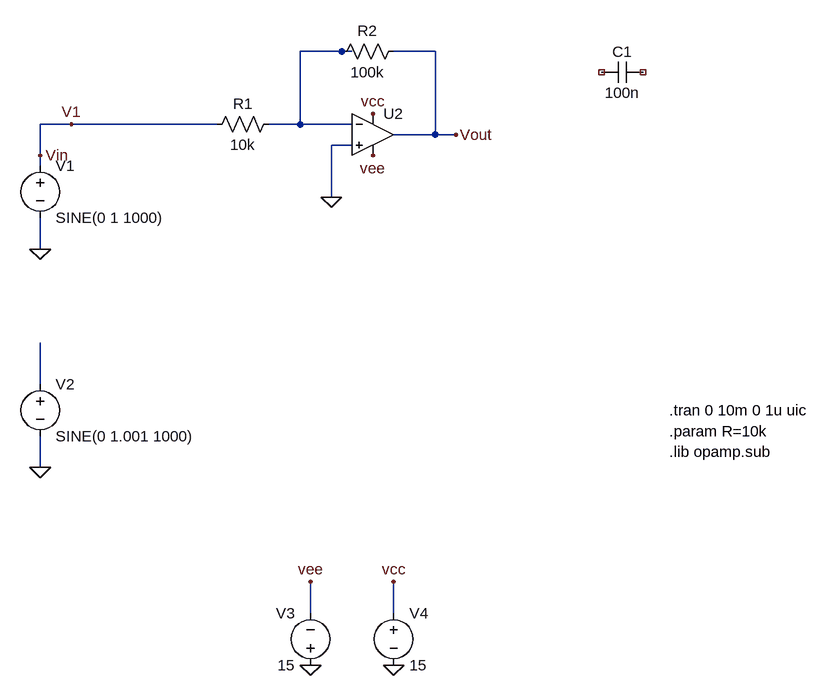
[diagram p0: schematic estudo1.asc]
estudo1.asc, the LTspice schematic file:
Version 4.1
SHEET 1 1364 708
WIRE 16 -256 -48 -256
WIRE 32 -256 16 -256
WIRE 160 -256 96 -256
WIRE -400 -144 -448 -144
WIRE -176 -144 -400 -144
WIRE -48 -144 -48 -256
WIRE -48 -144 -96 -144
WIRE 32 -144 -48 -144
WIRE 160 -128 160 -256
WIRE 160 -128 96 -128
WIRE 192 -128 160 -128
WIRE 32 -112 0 -112
WIRE -448 -96 -448 -144
WIRE -448 -80 -448 -96
WIRE 0 -32 0 -112
WIRE -448 48 -448 0
WIRE -448 256 -448 192
WIRE -448 384 -448 336
WIRE -32 608 -32 560
WIRE 96 608 96 560
FLAG -448 48 0
FLAG -448 384 0
FLAG 64 -96 vee
FLAG 64 -160 vcc
FLAG -32 688 0
FLAG 96 688 0
FLAG -400 -144 V1
FLAG -32 560 vee
FLAG 96 560 vcc
FLAG 0 -32 0
FLAG 192 -128 Vout
FLAG -448 -96 Vin
SYMBOL voltage -448 -96 R0
WINDOW 123 0 0 Left 0
WINDOW 39 0 0 Left 0
SYMATTR InstName V1
SYMATTR Value SINE(0 1 1000)
SYMBOL voltage -448 240 R0
WINDOW 123 0 0 Left 0
WINDOW 39 0 0 Left 0
SYMATTR InstName V2
SYMATTR Value SINE(0 1.001 1000)
SYMBOL voltage -32 704 R180
WINDOW 0 24 96 Left 2
WINDOW 3 24 16 Left 2
WINDOW 123 0 0 Left 0
WINDOW 39 0 0 Left 0
SYMATTR InstName V3
SYMATTR Value 15
SYMBOL voltage 96 592 R0
WINDOW 123 0 0 Left 0
WINDOW 39 0 0 Left 0
SYMATTR InstName V4
SYMATTR Value 15
SYMBOL OpAmps\\UniversalOpAmp2 64 -128 R0
SYMATTR InstName U2
SYMBOL res -80 -160 R90
WINDOW 0 0 56 VBottom 2
WINDOW 3 32 56 VTop 2
SYMATTR InstName R1
SYMATTR Value 10k
SYMBOL res 112 -272 R90
WINDOW 0 0 56 VBottom 2
WINDOW 3 32 56 VTop 2
SYMATTR InstName R2
SYMATTR Value 100k
SYMBOL cap 416 -240 M90
WINDOW 0 0 32 VBottom 2
WINDOW 3 32 32 VTop 2
SYMATTR InstName C1
SYMATTR Value 100n
TEXT 520 296 Left 2 !.tran 0 10m 0 1u uic
TEXT 520 328 Left 2 !.param R=10k
TEXT 520 360 Left 2 !.lib opamp.sub

The netlist it stands for:
* estudo1.asc
V1 Vin 0 SINE(0 1 1000)
V2 N002 0 SINE(0 1.001 1000)
V3 0 vee 15
V4 vcc 0 15
X§U2 0 N001 vcc vee Vout level2 Avol=1Meg GBW=10Meg Slew=10Meg Ilimit=25m Rail=0 Vos=0 En=0 Enk=0 In=0 Ink=0 Rin=500Meg  ; pins In+ In- V+ V- OUT
R1 N001 Vin 10k
R2 Vout N001 100k
C1 NC_01 NC_02 100n
.tran 0 10m 0 1u uic
.param R=10k
.lib opamp.sub
.lib UniversalOpAmp2.lib
.backanno
.end

* Results of the author's LTspice run, read from the files saved beside the schematic
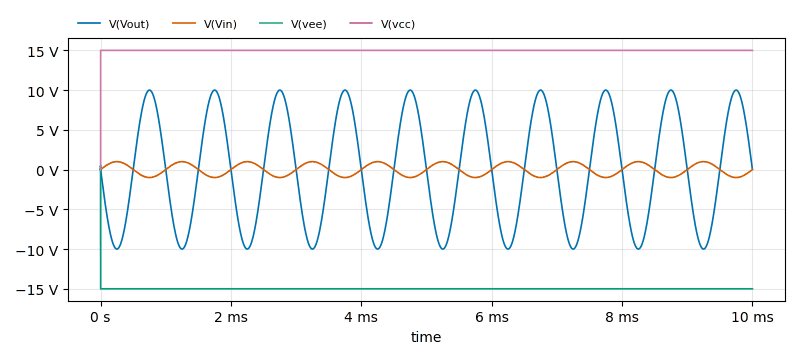
[diagram p1: Transient Analysis of estudo1.asc, plotted from the saved traces]
* Transient Analysis, 1 run:
*   V(Vout): min -10 V, max 10 V, average 8.647 µV, rms 7.071 V, last 10.97 mV
*   V(Vin): min -1 V, max 1 V, average 0 V, rms 707.1 mV, last 0 V
*   V(vee): min -15 V, max 0 V, average -15 V, rms 15 V, last -15 V
*   V(vcc): min 0 V, max 15 V, average 15 V, rms 15 V, last 15 V